# Altium project Oxy_Cube.PrjPcb (part 2 of 2)

## Sheet SENSORS.SchDoc
size A; DocumentNumber: 5; SheetNumber: 5; SheetTotal: 6
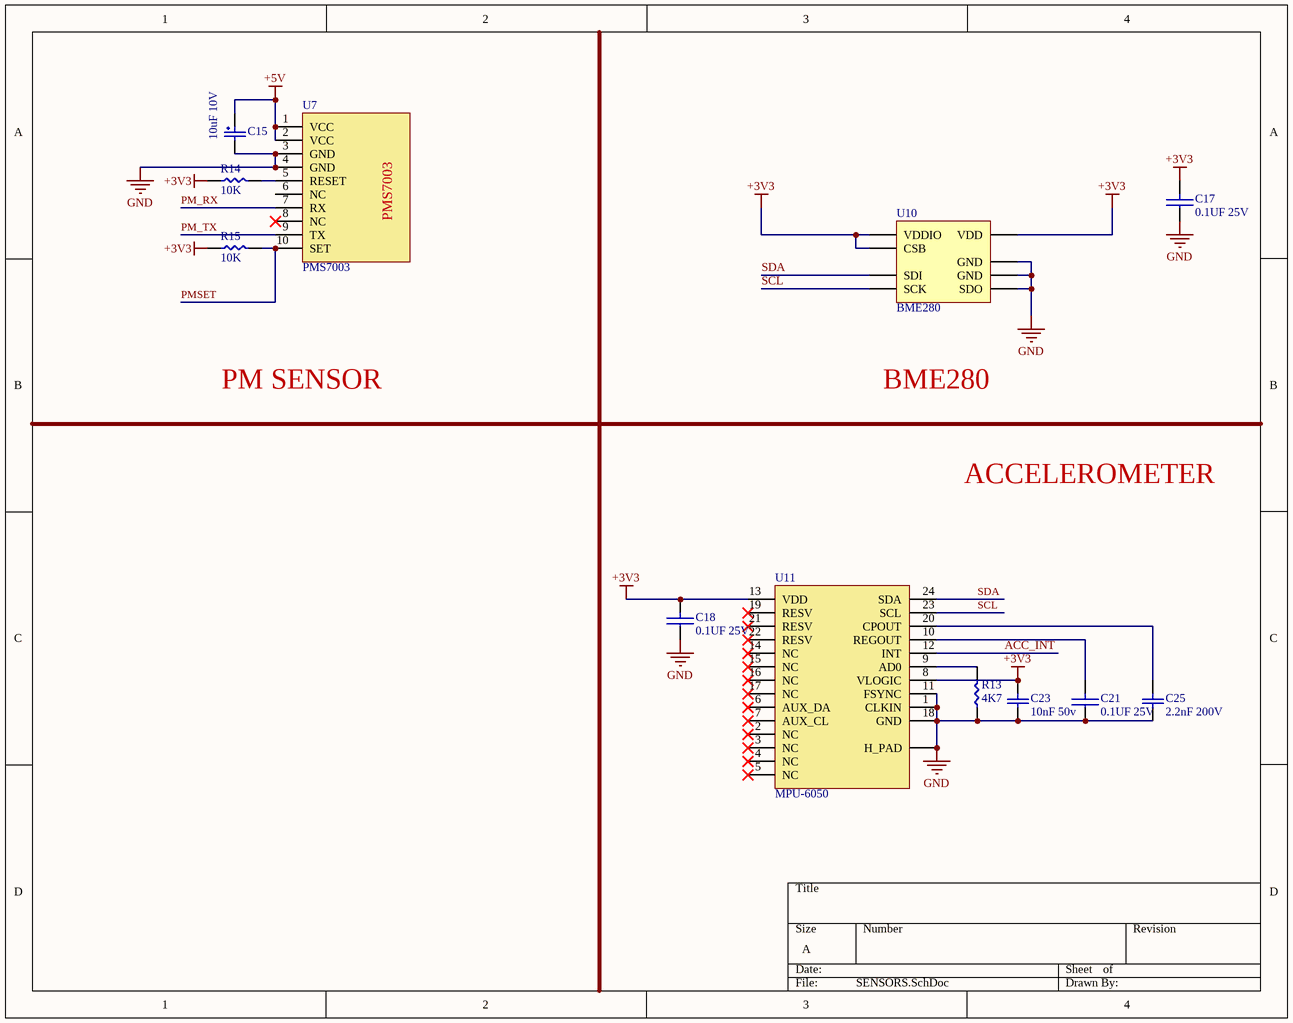
[diagram p5: SENSORS.SchDoc]

### Parts
C15  10uF 10V  [C3216]
C17  0.1UF 25V  [C0603]
C18  0.1UF 25V  [C0603]
C21  0.1UF 25V  [C0603]
C23  10nF 50v  [C0603]
C25  2.2nF 200V  [C0603]
R13  4K7  [R0603]
R14  10K  [R0603]
R15  10K  [R0603]
U7  PMS7003  [PMS7003]
U10  BME280  [BME280]
U11  MPU-6050  [MPU6050]

### Nets
+3V3: C17.2 C18.2 C23.2 R14.1 R15.1 U10.2(CSB) U10.6(VDDIO) U10.8(VDD) U11.8(VLOGIC) U11.13(VDD)
+5V: C15.2 U7.1(VCC) U7.2(VCC)
GND: C15.1 C17.1 C18.1 C21.1 C23.1 C25.1 R13.1 U7.3(GND) U7.4(GND) U10.1(GND) U10.5(SDO) U10.7(GND) U11.1(CLKIN) U11.11(FSYNC) U11.18(GND) U11.25(H_PAD)
ACC_INT: U11.12(INT)
PM_RX: U7.7(RX)
PM_TX: U7.9(TX)
PMSET: R15.2 U7.10(SET)
SCL: U10.4(SCK) U11.23(SCL)
SDA: U10.3(SDI) U11.24(SDA)
NetC21_2: C21.2 U11.10(REGOUT)
NetC25_2: C25.2 U11.20(CPOUT)
NetR13_2: R13.2 U11.9(AD0)
NetR14_2: R14.2 U7.5(RESET)

Not connected (* = marked no-connect by the designer): U7 6(NC) 8(NC)*; U11 2(NC)* 3(NC)* 4(NC)* 5(NC)* 6(AUX_DA)* 7(AUX_CL)* 14(NC)* 15(NC)* 16(NC)* 17(NC)* 19(RESV)* 21(RESV)* 22(RESV)*

### Notes on the sheet
- PM SENSOR
- BME280
- ACCELEROMETER

### Library data of the parts
C15 = T491A106K010AT: CAP TANT 10UF 10V 10% 1206; Manufacturer: KEMET; Manufacturer Size Code: A; Type: Molded; ESR (Equivalent Series Resistance): 3.8 Ohm; Lifetime @ Temp.: 2000 Hrs @ 85°C; Supplier 1: Digi-Key; Manufacturer Part Number: T491A106K010AT; RoHS: RoHS Compliant; Category: Capacitors; Stock 1: 741056; Pricing 1: 1=0.41, 10=0.287, 100=0.1721, 500=0.12912, 1000=0.10903 (USD); Packaging: Cut Tape (CT); Part Status: Active; Tolerance: ±10%; Operating Temperature: -55°C ~ 125°C; Mounting Type: Surface Mount; Package / Case: 1206 (3216 Metric); Size / Dimension: 0.126" L x 0.063" W (3.20mm x 1.60mm); Height - Seated (Max): 0.071" (1.80mm); Lead Spacing: -; Features: General Purpose; Failure Rate: -; ComponentLink1URL: http://www.kemet.com/Lists/ProductCatalog/Attachments/254/KEM_T2005_T491.pdf; ComponentLink1Description: http://www.kemet.com/Lists/ProductCatalog/Attachments/254/KEM_T2005_T491.pdf; Supplier Part Number 1: 399-3684-1-ND
C17 C18 C21 = 06033D104KAT2A: CAP CER 0.1UF 25V X5R 0603; Manufacturer: Kyocera AVX; Capacitance: 100 nF; Tolerance (%): ±10 %; Supplier 1: Digi-Key; Manufacturer Part Number: 06033D104KAT2A; Stock 1: 0; Pricing 1: 1=0.32, 10=0.221, 100=0.1328, 500=0.0996, 1000=0.0841 (USD); Case Size/Dimension: 0603; Dielectric: X5R; Rated Voltage: 25 V; ComponentLink1URL: https://datasheet.ciiva.com/19475/1031061-19475906.pdf; ComponentLink1Description: https://datasheet.ciiva.com/19475/1031061-19475906.pdf; ComponentLink2URL: https://datasheet.ciiva.com/28613/759405-28613274.pdf; ComponentLink2Description: https://datasheet.ciiva.com/28613/759405-28613274.pdf; ComponentLink3URL: https://datasheet.ciiva.com/16397/cx5r-16397162.pdf; ComponentLink3Description: https://datasheet.ciiva.com/16397/cx5r-16397162.pdf; ComponentLink4URL: https://datasheet.ciiva.com/28613/1666675-28613037.pdf; ComponentLink4Description: https://datasheet.ciiva.com/28613/1666675-28613037.pdf; ComponentLink5URL: https://datasheet.ciiva.com/28613/1666675-28613275.pdf; ComponentLink5Description: https://datasheet.ciiva.com/28613/1666675-28613275.pdf; ComponentLink6URL: https://datasheet.ciiva.com/152/cx5r-152227.pdf; ComponentLink6Description: https://datasheet.ciiva.com/152/cx5r-152227.pdf; ComponentLink7URL: https://datasheet.ciiva.com/152/cx5r-152226.pdf; ComponentLink7Description: https://datasheet.ciiva.com/152/cx5r-152226.pdf; ComponentLink8URL: https://datasheet.ciiva.com/2987/cx5r-2987761.pdf; ComponentLink8Description: https://datasheet.ciiva.com/2987/cx5r-2987761.pdf; ComponentLink9URL: https://datasheet.ciiva.com/152/cx5r-152225.pdf; ComponentLink9Description: https://datasheet.ciiva.com/152/cx5r-152225.pdf; ComponentLink10URL: https://datasheet.ciiva.com/2987/cx5r-2987762.pdf; ComponentLink10Description: https://datasheet.ciiva.com/2987/cx5r-2987762.pdf; Supplier Part Number 1: 478-1244-6-ND
C23 = CC0603KRX7R9BB103 (2): Cap Ceramic 0.01uF 50V X7R 10% SMD 0603 125C Automotive T/R; Manufacturer: Yageo; Product Training Modules: Multilayer Ceramic Capacitors; Featured Product: Commodity Multilayer Ceramic Capacitors – CC Series; Capacitance: 10000pF; Online Catalog: CC Series; Other Names: 311-1085-6; Supplier 1: Digi-Key; Manufacturer Part Number: CC0603KRX7R9BB103; Stock 1: 7014916; Pricing 1: 1=0.1, 10=0.037, 100=0.0165, 500=0.0118, 1000=0.0092 (USD); Standard Package: 1; Category: Capacitors; Family: Ceramic Capacitors; Series: CC; Packaging: Digi-Reel®; Tolerance: ±10%; Voltage - Rated: 50V; Temperature Coefficient: X7R; Mounting Type: Surface Mount, MLCC; Operating Temperature: -55°C ~ 125°C; Applications: General Purpose; Ratings: -; Package / Case: 0603 (1608 Metric); Size / Dimension: 0.063" L x 0.031" W (1.60mm x 0.80mm); Height - Seated (Max): -; Thickness (Max): 0.035" (0.90mm); Lead Spacing: -; Features: -; Lead Style: -; ComponentLink1URL: http://www.farnell.com/datasheets/2167236.pdf?src-supplier=Element14; ComponentLink1Description: http://www.farnell.com/datasheets/2167236.pdf?src-supplier=Element14; ComponentLink2URL: http://www.yageo.com/documents/recent/UPY-GPHC_X7R_6.3V-to-50V_18.pdf?src-supplier=Digi-Key; ComponentLink2Description: http://www.yageo.com/documents/recent/UPY-GPHC_X7R_6.3V-to-50V_18.pdf?src-supplier=Digi-Key; ComponentLink3URL: http://www.farnell.com/datasheets/2167236.pdf?src-supplier=Mouser; ComponentLink3Description: http://www.farnell.com/datasheets/2167236.pdf?src-supplier=Mouser; ComponentLink4URL: http://www.farnell.com/datasheets/70765.pdf?src-supplier=Element14; ComponentLink4Description: http://www.farnell.com/datasheets/70765.pdf?src-supplier=Element14; ComponentLink5URL: http://www.yageo.com/documents/recent/UPY-GPHC_X7R_6.3V-to-50V_8.pdf?src-supplier=Avnet+Europe; ComponentLink5Description: http://www.yageo.com/documents/recent/UPY-GPHC_X7R_6.3V-to-50V_8.pdf?src-supplier=Avnet+Europe; ComponentLink6URL: http://www.farnell.com/datasheets/1489800.pdf?src-supplier=Element14; ComponentLink6Description: http://www.farnell.com/datasheets/1489800.pdf?src-supplier=Element14; ComponentLink7URL: https://www.verical.com/server-webapp/html/getDatasheet?partID=403582&src-supplier=Verical; ComponentLink7Description: https://www.verical.com/server-webapp/html/getDatasheet?partID=403582&src-supplier=Verical; Supplier Part Number 1: 311-1085-1-ND
C25 = C0603C222K2RACTU: CAP CER 2200PF 200V X7R 0603; Manufacturer: KEMET; Part # Aliases: C0603C222K2RAC7867; Capacitance - uF: 0.0022 uF; Case Height: 0.8 mm; Case Length: 1.6 mm; Class: Class 1; Dissipation Factor DF: 10; Tolerance: 10 %; Temperature Coefficient / Code: +/- 15 %; Type: SMD MLCC X7R 6.3 - 250 VDC Commerical Grade; Supplier 1: Digi-Key; Manufacturer Part Number: C0603C222K2RACTU; Stock 1: 6991; Pricing 1: 1=0.38, 10=0.262, 100=0.157, 500=0.1177, 1000=0.0994 (USD); Brand: Kemet; Capacitance: 2200 pF; Capacitance - nF: 2.2 nF; Case Code - in: 0603; Case Code - mm: 1608; Dimensions: 0.8 mm W x 1.6 mm L x 0.8 mm H; Dielectric: X7R; Case Width: 0.8 mm; Factory Pack Quantity: 4000; Voltage Rating: 200 V; Product Category: Multilayer Ceramic Capacitors MLCC - SMD/SMT; RoHS: Details; Minimum Operating Temperature: - 55 C; Maximum Operating Temperature: + 125 C; Product: General Type MLCCs; Operating Temperature Range: - 55 C to + 125 C; Package / Case: 0603 (1608 metric); Packaging: Reel; Series: C0603C; Termination Style: SMD/SMT; Voltage Rating DC: 200 V; ComponentLink1URL: http://www.farnell.com/datasheets/1633156.pdf?src-supplier=Element14; ComponentLink1Description: http://www.farnell.com/datasheets/1633156.pdf?src-supplier=Element14; ComponentLink2URL: http://www.farnell.com/datasheets/1851736.pdf?src-supplier=Element14; ComponentLink2Description: http://www.farnell.com/datasheets/1851736.pdf?src-supplier=Element14; Supplier Part Number 1: 399-14504-1-ND
R13 = CRCW06034K70FKEA: RES SMD 4.7K OHM 1% 1/10W 0603; Manufacturer: Vishay; Categories: Resistors; Resistance: 4.7 kOhms; Power (Watts): 0.1W, 1/10W; Temperature Coefficient: ±100ppm/°C; Supplier 1: Digi-Key; Manufacturer Part Number: CRCW06034K70FKEA; Stock 1: 0; Pricing 1: 1=0.1, 10=0.036, 100=0.0146, 1000=0.0065, 2500=0.0057 (USD); Series: CRCW; Packaging: Digi-Reel®; Part Status: Active; Tolerance: ±1%; Composition: Thick Film; Features: Automotive AEC-Q200; Operating Temperature: -55°C ~ 155°C; Package / Case: 0603 (1608 Metric); Supplier Device Package: 0603; Size / Dimension: 0.061 L x 0.033 W (1.55mm x 0.85mm); Height - Seated (Max): 0.020 (0.50mm); Number of Terminations: 2; Failure Rate: -; ComponentLink1URL: http://uk.rs-online.com/webdocs/0d98/0900766b80d98afc.pdf?src-supplier=RSComponents; ComponentLink1Description: http://uk.rs-online.com/webdocs/0d98/0900766b80d98afc.pdf?src-supplier=RSComponents; ComponentLink2URL: https://www.verical.com/server-webapp/html/getDatasheet?partID=33073&src-supplier=Verical; ComponentLink2Description: https://www.verical.com/server-webapp/html/getDatasheet?partID=33073&src-supplier=Verical; ComponentLink3URL: http://www.vishay.com/docs/20035/dcrcwe3.pdf?src-supplier=Future+Electronics; ComponentLink3Description: http://www.vishay.com/docs/20035/dcrcwe3.pdf?src-supplier=Future+Electronics; ComponentLink4URL: https://www.alliedelec.com/m/d/0c934d6939ccefa68dbe0b96d821c8cf.pdf?src-supplier=Allied+Electronics; ComponentLink4Description: https://www.alliedelec.com/m/d/0c934d6939ccefa68dbe0b96d821c8cf.pdf?src-supplier=Allied+Electronics; ComponentLink5URL: http://www.vishay.com/docs/20035/dcrcwe3.pdf?src-supplier=Avnet+Asia; ComponentLink5Description: http://www.vishay.com/docs/20035/dcrcwe3.pdf?src-supplier=Avnet+Asia; ComponentLink6URL: http://www.farnell.com/datasheets/2046716.pdf?src-supplier=Element14; ComponentLink6Description: http://www.farnell.com/datasheets/2046716.pdf?src-supplier=Element14; ComponentLink7URL: https://www.distrelec.biz/Web/Downloads/a_/en/flD-CRCW-e3_data_en.pdf?mime=application%2Fpdf&src-supplier=Distrelec; ComponentLink7Description: https://www.distrelec.biz/Web/Downloads/a_/en/flD-CRCW-e3_data_en.pdf?mime=application%2Fpdf&src-supplier=Distrelec; Supplier Part Number 1: 541-4.70KHCT-ND
R14 R15 = RC0603FR-0710KL: RES SMD 10K OHM 1% 1/10W 0603; Manufacturer: Yageo; Power (Watts): 0.1W, 1/10W; Temperature Coefficient: ±100ppm/°C; Supplier 1: Digi-Key; Manufacturer Part Number: RC0603FR-0710KL; RoHS: RoHS Compliant; Category: Resistors; Stock 1: 5916612; Pricing 1: 1=0.1, 10=0.015, 100=0.006, 1000=0.00268, 2500=0.00233 (USD); Packaging: Digi-Reel®; Part Status: Active; Tolerance: ±1%; Composition: Thick Film; Features: Moisture Resistant; Operating Temperature: -55°C ~ 155°C; Package / Case: 0603 (1608 Metric); Supplier Device Package: 0603; Size / Dimension: 0.063" L x 0.032" W (1.60mm x 0.80mm); Height - Seated (Max): 0.022" (0.55mm); Failure Rate: -; ComponentLink1URL: http://www.yageo.com/documents/recent/PYu-RC_Group_51_RoHS_L_8.pdf; ComponentLink1Description: http://www.yageo.com/documents/recent/PYu-RC_Group_51_RoHS_L_8.pdf; Supplier Part Number 1: 311-10.0KHRDKR-ND
U10 = BME280: Pressure, Temperature and Humidity Sensor Digital Output 1.8V 8-Pin LGA T/R; Manufacturer: Bosch; Categories: Sensors, Transducers; Sensor Type: Humidity, Pressure, Temperature; Humidity Range: 0 ~ 100% RH; Output Type: I²C, SPI; Output: 16b; Accuracy: ±3%; Response Time: 1s; Voltage - Supply: 1.71 V ~ 3.6 V; Supplier 1: Digi-Key; Manufacturer Part Number: BME280; Stock 1: 18503; Pricing 1: 1=6.55, 5=5.776, 10=5.101, 25=4.1388, 50=3.6576, 100=3.5613, 500=2.9838, 1000=2.7913, 5000=2.5988 (USD); Series: -; Packaging: Cut Tape (CT); Part Status: Active; Sensitivity: -; Mounting Type: Surface Mount; Operating Temperature: -40°C ~ 85°C; Package / Case: 8-VFLGA; Supplier Device Package: 8-LGA (2.5x2.5); ComponentLink1URL: https://ae-bst.resource.bosch.com/media/_tech/media/datasheets/BST-BME280-DS002.pdf?src-supplier=Digi-Key; ComponentLink1Description: https://ae-bst.resource.bosch.com/media/_tech/media/datasheets/BST-BME280-DS002.pdf?src-supplier=Digi-Key; ComponentLink2URL: https://ae-bst.resource.bosch.com/media/_tech/media/product_flyer/BME280_Productflyer_BST_20170109.pdf?src-supplier=Arrow; ComponentLink2Description: https://ae-bst.resource.bosch.com/media/_tech/media/product_flyer/BME280_Productflyer_BST_20170109.pdf?src-supplier=Arrow; ComponentLink3URL: https://ae-bst.resource.bosch.com/media/_tech/media/product_flyer/BME280_Productflyer_BST_20170109.pdf?src-supplier=Mouser; ComponentLink3Description: https://ae-bst.resource.bosch.com/media/_tech/media/product_flyer/BME280_Productflyer_BST_20170109.pdf?src-supplier=Mouser; ComponentLink4URL: https://ae-bst.resource.bosch.com/media/_tech/media/product_flyer/BME280_Productflyer_BST_20170109.pdf?src-supplier=NAC+Semi; ComponentLink4Description: https://ae-bst.resource.bosch.com/media/_tech/media/product_flyer/BME280_Productflyer_BST_20170109.pdf?src-supplier=NAC+Semi; Supplier Part Number 1: 828-1063-1-ND
U11 = MPU-6050: IMU ACCEL/GYRO 3-AXIS I2C 24QFN; Manufacturer: TDK InvenSense; Sensor Type: Accelerometer, Gyroscope, 3 Axis; Output Type: I²C; Supplier 1: Digi-Key; Manufacturer Part Number: MPU-6050; RoHS: RoHS Compliant; Category: Sensors, Transducers; Stock 1: 22313; Pricing 1: 1=8.25, 5=7.232, 10=6.509, 25=5.786, 50=5.352, 100=4.6288, 500=4.3395, 1000=4.0502 (USD); Part Status: Not For New Designs; Operating Temperature: -40°C ~ 85°C (TA); ComponentLink1URL: http://store.invensense.com/datasheets/invensense/MPU-6050_DataSheet_V3%204.pdf; ComponentLink1Description: http://store.invensense.com/datasheets/invensense/MPU-6050_DataSheet_V3%204.pdf; Supplier Part Number 1: 1428-1007-1-ND

## Nets that join several sheets
+3V3: ESP32 (12 pins), POWER (5 pins), PROGRAMMER (U9.7 U9.10), SENSORS (10 pins)
+5V: LEDS (8 pins), POWER (C19.2 C20.2 D6.2 U6.2), SENSORS (C15.2 U7.1 U7.2)
+VUSB: POWER (C7.2 U3.4), PROGRAMMER (F1.2)
GND: ESP32 (6 pins), LEDS (8 pins), POWER (17 pins), PROGRAMMER (U8.1 U9.3), SENSORS (16 pins)
BATTERY_ALERT: ESP32 (U12.16), POWER (U4.8)
CHGSTAT: ESP32 (U12.24), POWER (U3.1)
DIN: ESP32 (R1.1), LEDS (D4.4)
ENABLE_PM_SENSOR: ESP32 (U12.14), POWER (U6.1)
PM_RX: ESP32 (U12.28), SENSORS (U7.7)
PM_TX: ESP32 (U12.29), SENSORS (U7.9)
PMSET: ESP32 (U12.20), SENSORS (R15.2 U7.10)
POWER_HOLD: ESP32 (U12.35), POWER (U5.4)
POWER_INTERRUPT: ESP32 (U12.36), POWER (R11.1 U5.11)
POWER_STATUS: ESP32 (U12.38), POWER (R10.1 U5.8)
RX: ESP32 (U12.41), PROGRAMMER (U9.9)
SCL: ESP32 (U12.39), POWER (U4.3), SENSORS (U10.4 U11.23)
SDA: ESP32 (U12.42), POWER (U4.4), SENSORS (U10.3 U11.24)
TX: ESP32 (U12.40), PROGRAMMER (R12.2)